# EAGLE schematic Vehicle_Kill_Switch_Wiring (EAGLE 7.1.0)
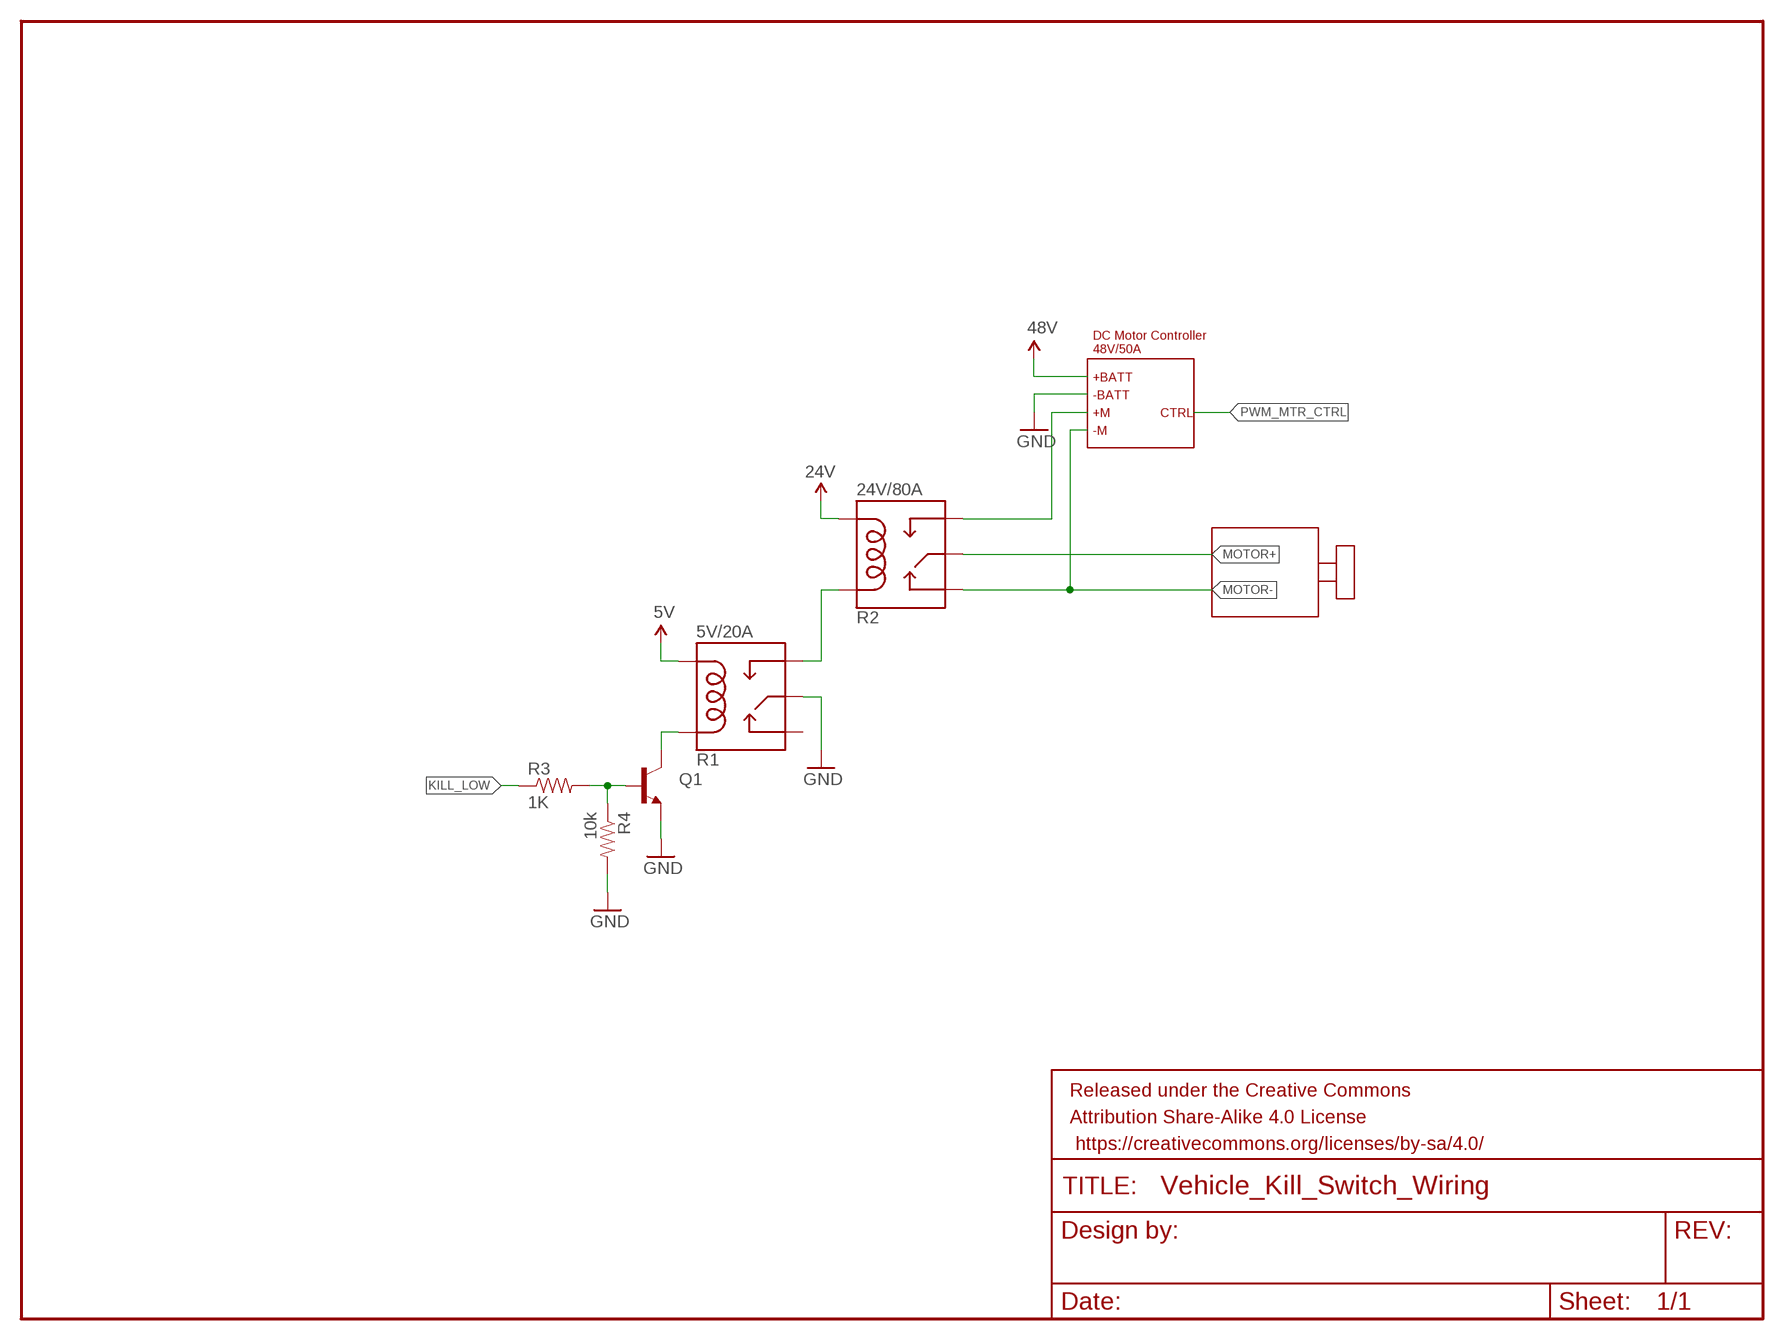
[diagram p0: schematic, sheet 1]

## Parts
FRAME1  FRAME-LETTER  [CREATIVE_COMMONS]
Q1  TRANSISTOR_NPN2N3904  [TO-92]
R1  5V/20A  RELAYPTH  [RELAY-G5Q]
R2  24V/80A  RELAYPTH  [RELAY-G5Q]
R3  1K  1KOHM-1/4W-1%(PTH)  [AXIAL-0.3]
R4  10k  10KOHM-1/4W-1%(PTH)HORIZ  [AXIAL-0.3]

## Nets
48VFROM_CONTROLLER: R2.3(NO)
GND: Q1.1(E) R1.2(MAIN) R4.P$2
KILL_LOW: R3.P$1
MOTOR+: R2.2(MAIN)
MOTOR-: R2.4(NC)
N$1: R1.3(NO) R2.5(COIL1)
N$2: Q1.3(C) R1.5(COIL1)
N$3: Q1.2(B) R3.P$2 R4.P$1
VCC_1: R2.1(COIL2) ; supply symbol labelled 24V
VCC_2: R1.1(COIL2) ; supply symbol labelled 5V
Unconnected: R1.4(NC)

## Notes on the sheet
- DC Motor Controller
  48V/50A
- +BATT
- -BATT
- +M | CTRL
- -M

## Library data of the parts
FRAME1 = SparkFun-Aesthetics:FRAME-LETTER: Schematic Frame Standard 8.5x11 US Letter frame
Q1 = SparkFun-DiscreteSemi:TRANSISTOR_NPN: Generic NPN BJT MMBT2222A - TRANS-08049 (SOT-23, 1A 40V) MPSA42 - TRANS-09116 (SOT-23, 500mA 300V) MMBT5088LT1G - TRANS-11160 (SOT-23, 50 mA 30V) BC547 - COM-08928 <http://www.sparkfun.com/products/8928> (TO-92 45V 100mA) (1.Collector 2.Base 3.Emitter) 2N3904 - COM-00521 <http://www.sparkfun.com/products/521> (TO-92 40V 200mA) (1.Emitter 2.Base 3.Collector) P2N2222A - COM-12852 <http://www.sparkfun.com/products/12852> (TO-92 40V 600mA) (1.Collector 2.Base 3.Emitter); PROD_ID: TRANS-08447
R1 R2 = SparkFun-Electromechanical:RELAY: SPDT relay (COM-00101)
R3 = SparkFun-Resistors:1KOHM-1/4W-1%(PTH): RES-12182; PROD_ID: RES-12182
R4 = SparkFun-Resistors:10KOHM-1/4W-1%(PTH): RES-12183; PROD_ID: RES-12183